# EAGLE schematic FLC100_level_shifting (EAGLE 6.4)
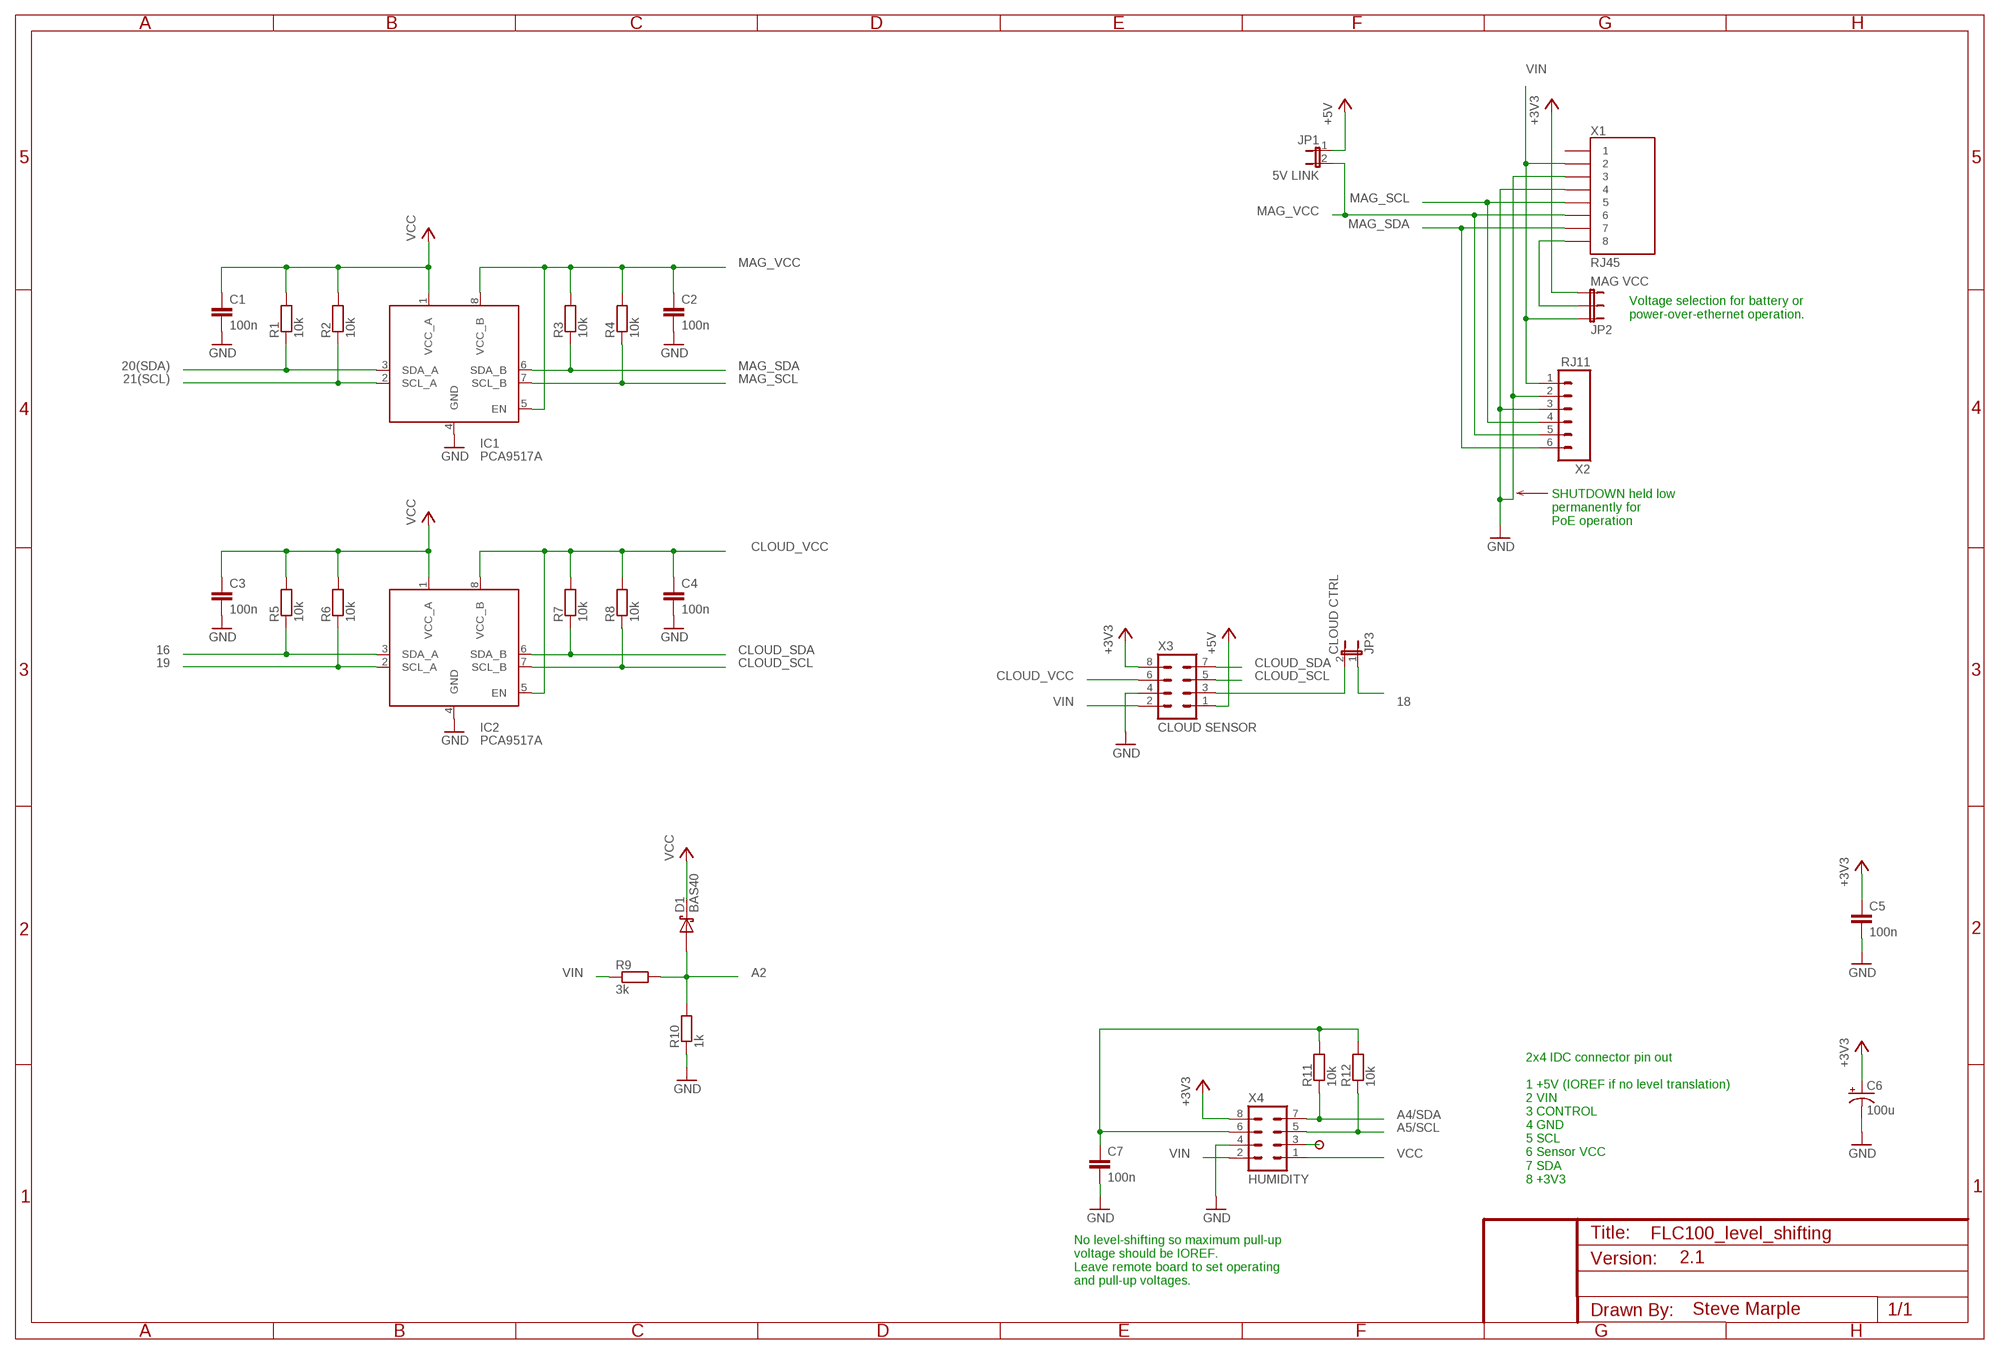
[diagram p0: schematic, sheet 1]

## Parts
C1  100n  C-EU1206-HAND  [1206-HAND]
C2  100n  C-EU1206-HAND  [1206-HAND]
C3  100n  C-EU1206-HAND  [1206-HAND]
C4  100n  C-EU1206-HAND  [1206-HAND]
C5  100n  C-EU1206-HAND  [1206-HAND]
C6  100u  CAP_POLPTH2  [CPOL-RADIAL-10UF-25V]
C7  100n  C-EU1206-HAND  [1206-HAND]
D1  BAS40  DIODE-SCHOTTKYSOT23-1-3-HAND  [SOT23-3-HAND]
IC1  PCA9517A  PCA9517ASOIC  [SO08]
IC2  PCA9517A  PCA9517ASOIC  [SO08]
JP1  5V LINK  JUMPER-2PTH  [1X02]
JP2  MAG VCC  JUMPER-3PTH  [1X03]
JP3  CLOUD CTRL  JUMPER-2PTH  [1X02]
R1  10k  RESISTOR1206-HAND  [1206-HAND]
R2  10k  RESISTOR1206-HAND  [1206-HAND]
R3  10k  RESISTOR1206-HAND  [1206-HAND]
R4  10k  RESISTOR1206-HAND  [1206-HAND]
R5  10k  RESISTOR1206-HAND  [1206-HAND]
R6  10k  RESISTOR1206-HAND  [1206-HAND]
R7  10k  RESISTOR1206-HAND  [1206-HAND]
R8  10k  RESISTOR1206-HAND  [1206-HAND]
R9  3k  RESISTOR1206-HAND  [1206-HAND]
R10  1k  RESISTOR1206-HAND  [1206-HAND]
R11  10k  RESISTOR1206-HAND  [1206-HAND]
R12  10k  RESISTOR1206-HAND  [1206-HAND]
U$5  PAD  [PAD]
X1  RJ45  RJ45-8PTH  [RJ45-8]
X2  RJ11  RJ11-6PTH  [RJ11-6]
X3  CLOUD SENSOR  ML8  [ML8]
X4  HUMIDITY  ML8  [ML8]

## Nets
16: IC2.3(SDA_A) R5.1
18: JP3.1
19: IC2.2(SCL_A) R6.1
20(SDA): IC1.3(SDA_A) R1.1
21(SCL): IC1.2(SCL_A) R2.1
+3V3 [power]: C5.1 C6.1(+) JP2.3 X3.8 X4.8
+5V [power]: JP1.1 X3.1
A2 [power]: D1.1(A) R9.2 R10.2
A4/SDA: R11.1 X4.7
A5/SCL: R12.1 X4.5
CLOUD_SCL: IC2.7(SCL_B) R8.1 X3.5
CLOUD_SDA: IC2.6(SDA_B) R7.1 X3.7
CLOUD_VCC: C4.1 IC2.5(EN) IC2.8(VCC_B) R7.2 R8.2 X3.6
GND [power]: C1.2 C2.2 C3.2 C4.2 C5.2 C6.2(-) C7.2 IC1.4(GND) IC2.4(GND) R10.1 X1.3 X1.4 X2.2 X2.3 X3.4 X4.4
MAG_SCL: IC1.7(SCL_B) R4.1 X1.5 X2.4
MAG_SDA: IC1.6(SDA_B) R3.1 X1.7 X2.6
MAG_VCC: C2.1 IC1.5(EN) IC1.8(VCC_B) JP1.2 R3.2 R4.2 X1.6 X2.5
N$3: JP3.2 X3.3
N$7 [power]: JP2.2 X1.8
N$16: U$5.1 X4.3
N$22: C7.1 R11.2 R12.2 X4.6
VCC [power]: C1.1 C3.1 D1.3(C) IC1.1(VCC_A) IC2.1(VCC_A) R1.2 R2.2 R5.2 R6.2 X4.1
VIN [power]: JP2.1 R9.1 X1.2 X2.1 X3.2 X4.2
Unconnected: X1.1

## Notes on the sheet
- Voltage selection for battery or
  power-over-ethernet operation.
- SHUTDOWN held low
  permanently for 
  PoE operation
- 2x4 IDC connector pin out
  
  1 +5V (IOREF if no level translation)
  2 VIN
  3 CONTROL
  4 GND
  5 SCL
  6 Sensor VCC
  7 SDA
  8 +3V3
- No level-shifting so maximum pull-up
  voltage should be IOREF.
  Leave remote board to set operating
  and pull-up voltages.
- 2.1
- Steve Marple

## Library data of the parts
C1-C5 C7 = SteveMarple:C-EU
C6 = SteveMarple:CAP_POL: Capacitor Polarized These are standard SMD and PTH capacitors. Normally 10uF, 47uF, and 100uF in electrolytic and tantalum varieties. Always verify the external diameter of the through hole cap, it varies with capacity, voltage, and manufacturer. The EIA devices should be standard.
D1 = SteveMarple:DIODE-SCHOTTKY
IC1 IC2 = SteveMarple:PCA9517A
JP1 JP3 = SparkFun:JUMPER-2: Jumper Basic 0.1" spaced jumper. Use with breakaway headers.
JP2 = SparkFun:JUMPER-3
R1-R12 = SteveMarple:RESISTOR: 1/4W PTH resistor
U$5 = SteveMarple:PAD
X1 = SteveMarple:RJ45-8: RJ45 Jack Simple RJ45, 8-pin connection - connector for common Cat5, Cat5e, and Cat6 Ethernet cables. Footprint not yet proven in production. Connector sku is PRT-00643; Breakout PCB sku is BOB-00716.
X2 = SteveMarple:RJ11-6: RJ11 Jack Simple 6 pin RJ11 jack. Commonly found on CAT3 devices and Microchip programmers. SKU: PRT-00132
X3 X4 = SteveMarple:ML8

## Net classes
1 power: width 0.381 mm
2 antenna: width 0.381 mm